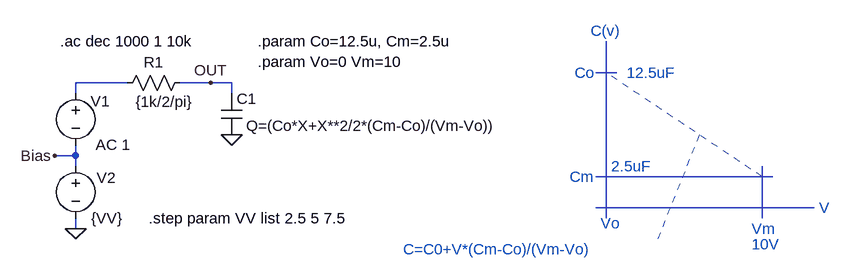
[diagram p0: schematic Fig_2-100_VdepndCap_Linear_AC.asc]
Fig_2-100_VdepndCap_Linear_AC.asc, the LTspice schematic file:
Version 4
SHEET 1 1276 680
WIRE 128 96 48 96
WIRE 256 96 208 96
WIRE 288 96 256 96
WIRE 48 112 48 96
WIRE 288 112 288 96
WIRE 48 208 48 192
WIRE 48 208 16 208
WIRE 48 224 48 208
WIRE 48 320 48 304
FLAG 48 320 0
FLAG 288 176 0
FLAG 256 96 OUT
FLAG 16 208 Bias
SYMBOL voltage 48 96 R0
WINDOW 0 23 28 Left 2
WINDOW 123 31 95 Left 2
WINDOW 39 0 0 Left 0
WINDOW 3 25 112 Left 2
SYMATTR InstName V1
SYMATTR Value2 AC 1
SYMATTR Value ""
SYMBOL cap 272 112 R0
WINDOW 3 38 50 Left 2
SYMATTR Value Q=(Co*X+X**2/2*(Cm-Co)/(Vm-Vo))
SYMATTR InstName C1
SYMBOL voltage 48 208 R0
WINDOW 0 32 34 Left 2
WINDOW 123 0 0 Left 0
WINDOW 39 0 0 Left 0
SYMATTR InstName V2
SYMATTR Value {VV}
SYMBOL res 112 112 R270
WINDOW 0 32 56 VTop 2
WINDOW 3 3 72 VBottom 2
SYMATTR InstName R1
SYMATTR Value {1k/2/pi}
TEXT 160 304 Left 2 !.step param VV list 2.5 5 7.5
TEXT 24 32 Left 2 !.ac dec 1000 1 10k
TEXT 328 32 Left 2 !.param Co=12.5u, Cm=2.5u\n.param Vo=0 Vm=10
TEXT 896 80 Left 2 ;12.5uF
TEXT 872 224 Left 2 ;2.5uF
TEXT 840 16 Left 2 ;C(v)
TEXT 1192 288 Left 2 ;V
TEXT 816 80 Left 2 ;Co
TEXT 808 240 Left 2 ;Cm
TEXT 1088 320 Left 2 ;Vm
TEXT 856 312 Left 2 ;Vo
TEXT 1088 344 Left 2 ;10V
TEXT 552 352 Left 2 ;C=C0+V*(Cm-Co)/(Vm-Vo)
LINE Normal 864 304 864 32
LINE Normal 1184 288 848 288
LINE Normal 1104 240 864 80 2
LINE Normal 1120 240 848 240
LINE Normal 1104 304 1104 224
LINE Normal 880 80 848 80
LINE Normal 944 336 1008 176 3

The netlist it stands for:
* Fig_2-100_VdepndCap_Linear_AC.asc
V1 N001 Bias AC 1
C1 OUT 0 Q=(Co*X+X**2/2*(Cm-Co)/(Vm-Vo))
V2 Bias 0 {VV}
R1 N001 OUT {1k/2/pi}
.step param VV list 2.5 5 7.5
.ac dec 1000 1 10k
.param Co=12.5u, Cm=2.5u
.param Vo=0 Vm=10
* 12.5uF
* 2.5uF
* C(v)
* V
* Co
* Cm
* Vm
* Vo
* 10V
* C=C0+V*(Cm-Co)/(Vm-Vo)
.backanno
.end